# Altium schematic sheet IF_Supply.SchDoc
size A4; SheetNumber: 5; SheetTotal: 6
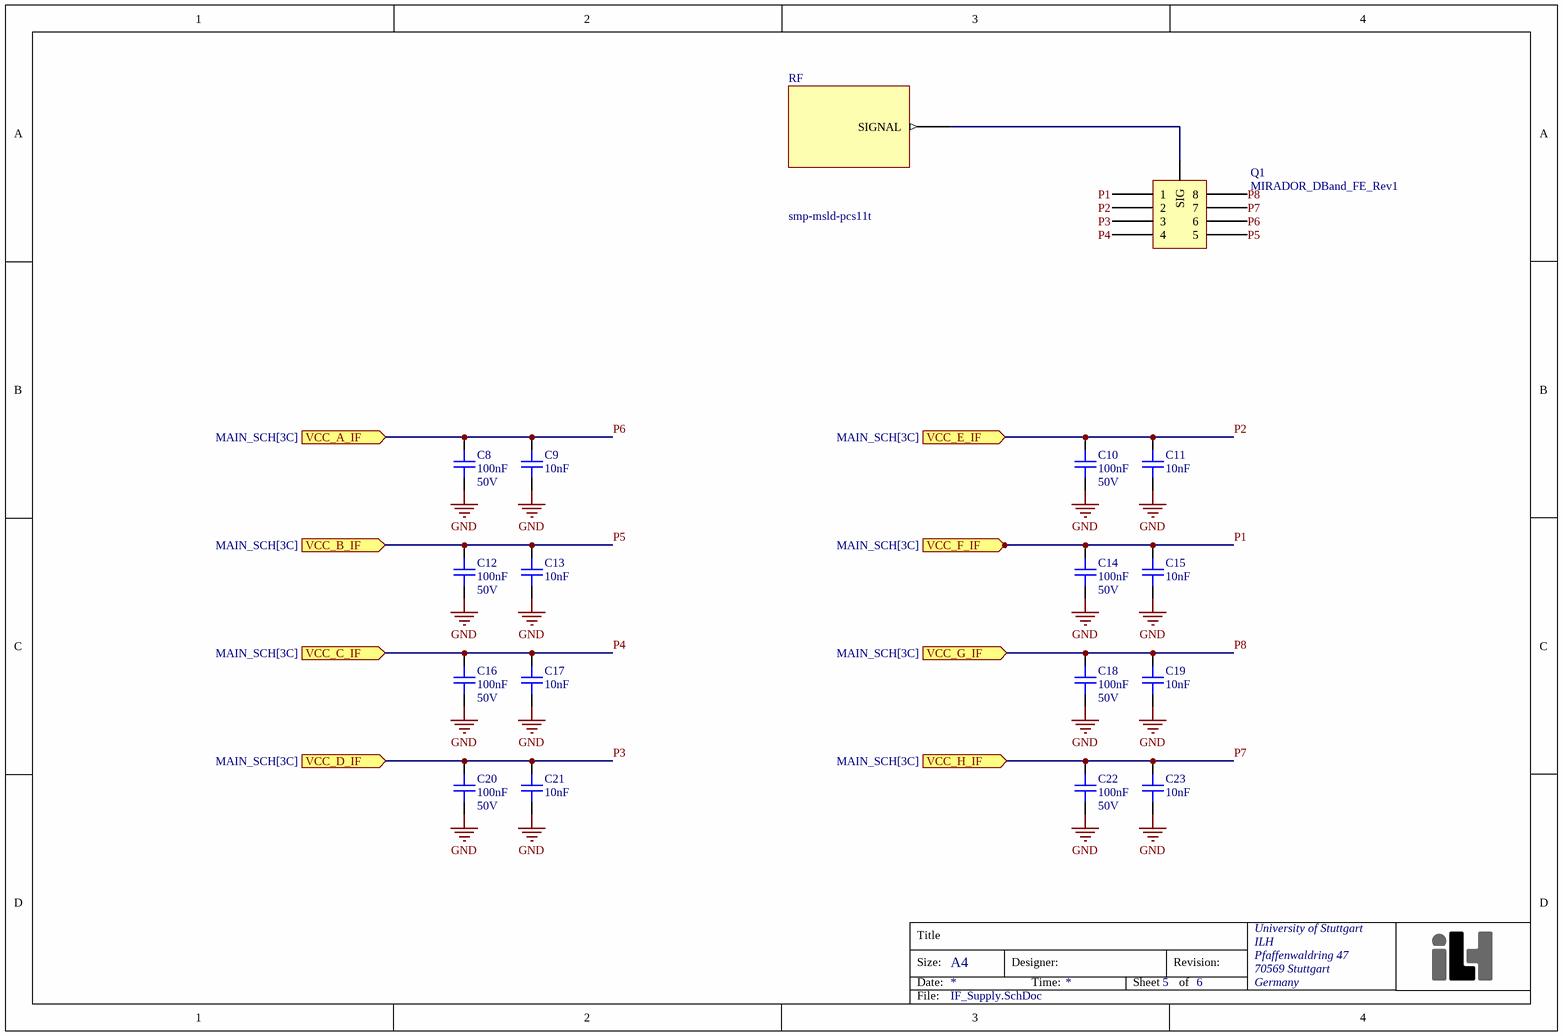
[diagram p0: IF_Supply.SchDoc]

## Parts
C8  value 100nF  Voltage Rating: 50V  [CAPC1608X90X35LL15T15]  (hidden comment: 06035C104KAT4A)
C9  value 10nF  [CAPC1050X55X23ML05T13]  (hidden comment: CL05B104KO5NNNC)
C10  value 100nF  Voltage Rating: 50V  [CAPC1608X90X35LL15T15]  (hidden comment: 06035C104KAT4A)
C11  value 10nF  [CAPC1050X55X23ML05T13]  (hidden comment: CL05B104KO5NNNC)
C12  value 100nF  Voltage Rating: 50V  [CAPC1608X90X35LL15T15]  (hidden comment: 06035C104KAT4A)
C13  value 10nF  [CAPC1050X55X23ML05T13]  (hidden comment: CL05B104KO5NNNC)
C14  value 100nF  Voltage Rating: 50V  [CAPC1608X90X35LL15T15]  (hidden comment: 06035C104KAT4A)
C15  value 10nF  [CAPC1050X55X23ML05T13]  (hidden comment: CL05B104KO5NNNC)
C16  value 100nF  Voltage Rating: 50V  [CAPC1608X90X35LL15T15]  (hidden comment: 06035C104KAT4A)
C17  value 10nF  [CAPC1050X55X23ML05T13]  (hidden comment: CL05B104KO5NNNC)
C18  value 100nF  Voltage Rating: 50V  [CAPC1608X90X35LL15T15]  (hidden comment: 06035C104KAT4A)
C19  value 10nF  [CAPC1050X55X23ML05T13]  (hidden comment: CL05B104KO5NNNC)
C20  value 100nF  Voltage Rating: 50V  [CAPC1608X90X35LL15T15]  (hidden comment: 06035C104KAT4A)
C21  value 10nF  [CAPC1050X55X23ML05T13]  (hidden comment: CL05B104KO5NNNC)
C22  value 100nF  Voltage Rating: 50V  [CAPC1608X90X35LL15T15]  (hidden comment: 06035C104KAT4A)
C23  value 10nF  [CAPC1050X55X23ML05T13]  (hidden comment: CL05B104KO5NNNC)
Q1  MIRADOR_DBand_FE_Rev1  [MMIC_SMM-Footprint-1]
RF  smp-msld-pcs11t  [SMP_FTP]

## Ports
VCC_A_IF (in, see MAIN_SCH[3C]), VCC_B_IF (in, see MAIN_SCH[3C]), VCC_C_IF (in, see MAIN_SCH[3C]), VCC_D_IF (in, see MAIN_SCH[3C]), VCC_E_IF (in, see MAIN_SCH[3C]), VCC_F_IF (in, see MAIN_SCH[3C]), VCC_G_IF (in, see MAIN_SCH[3C]), VCC_H_IF (in, see MAIN_SCH[3C])

## Nets
GND: C8.1 C9.1 C10.1 C11.1 C12.1 C13.1 C14.1 C15.1 C16.1 C17.1 C18.1 C19.1 C20.1 C21.1 C22.1 C23.1
P1: C14.2 C15.2 Q1.1 ; port VCC_F_IF
P2: C10.2 C11.2 Q1.2 ; port VCC_E_IF
P3: C20.2 C21.2 Q1.3 ; port VCC_D_IF
P4: C16.2 C17.2 Q1.4 ; port VCC_C_IF
P5: C12.2 C13.2 Q1.5 ; port VCC_B_IF
P6: C8.2 C9.2 Q1.6 ; port VCC_A_IF
P7: C22.2 C23.2 Q1.7 ; port VCC_H_IF
P8: C18.2 C19.2 Q1.8 ; port VCC_G_IF
NetQ1_SIG: Q1.SIG RF.2(SIGNAL)

## Notes on the sheet
- Title
- Size:
- Date:
- A4
- Designer:
- Time:
- Sheet
- Revision:
- of
- University of Stuttgart
- ILH
- Pfaffenwaldring 47
- 70569 Stuttgart
- Germany
- File:

## Library data of the parts
C8 C10 C12 C14 C16 C18 C20 C22 = CMP-001-00048-2: Ceramic Capacitor, Multilayer, Ceramic, 50V, 10% +Tol, 10% -Tol, X7R, 15% TC, 0.1uF, Surface Mount, 0603; Multilayer: Yes; Capacitance: 100 nF; Temperature Characteristics Code: X7R; Length: 1.6mm; Height: 0.9mm; Packaging: Tape and Reel; Tolerance: 10%; Mounting Technology: Surface Mount; Rated DC Voltage (URdc): 50V; Package Style: SMTMeter; Tolerance (fill in as +-): 10%; RoHS Compliant: Yes; Min Operating Temperature: -55°C; Capacitor Type: Ceramic; JESD-609 Code: e3; Terminal Finish: Nickel; Max Operating Temperature: 125°C; Pins: 2; Tolerance  (fill in as +-): 10%; Width: 0.81mm; Termination: Wraparound; Reach SVHC Compliant: Yes; Dielectric Material: Ceramic; Package Shape: Rectangular; Case/Package: 0603
C9 C11 C13 C15 C17 C19 C21 C23 = CMP-001-00053-1: Ceramic Capacitor, Multilayer, Ceramic, 16V, 10% +Tol, 10% -Tol, X7R, 15% TC, 0.1uF, Surface Mount, 0402; Multilayer: Yes; Case/Package: 0402; Tolerance (fill in as +-): 10%; Length: 1mm; Reach SVHC Compliant: Yes; Packaging: Tape and Reel; Package Shape: Rectangular; Width: 0.5mm; Mounting Technology: Surface Mount; Terminal Finish: Nickel; Max Operating Temperature: 125°C; Dielectric Material: Ceramic; Package Style: SMTMeter; Rated DC Voltage (URdc): 16V; Temperature Characteristics Code: X7R; Capacitor Type: Ceramic; JESD-609 Code: e3; Height: 0.55mm; Min Operating Temperature: -55°C; Termination: Wraparound; RoHS Compliant: Yes; Pins: 2; Tolerance  (fill in as +-): 10%
Q1 = MMIC_SMM_01-10: DC and IF bonded footprint of TWA+self-mixing mixer
RF = CMP-00053-13: RF Connector SMP Straight PCB Limited Detent Jack Surface Mount 50 Ohm footprint is made for Dk : 4.2 and height 800µm; Gender: m; Connector Type: smp; Mounting Technology: smd